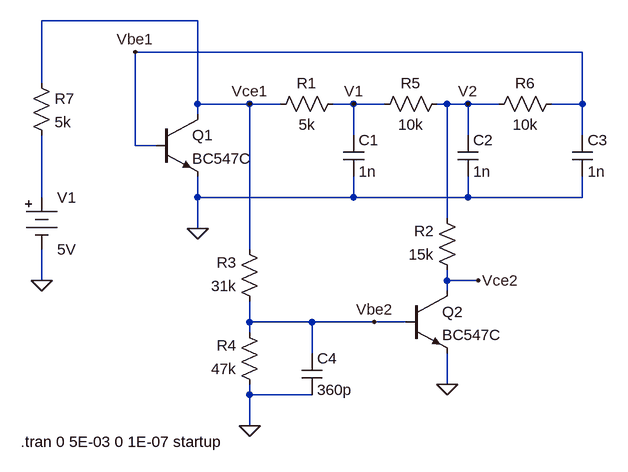
[diagram p0: schematic chaotic_oscillator.asc]
chaotic_oscillator.asc, the LTspice schematic file:
Version 4
SHEET 1 880 680
WIRE -176 -80 -416 -80
WIRE 416 -32 -272 -32
WIRE -416 16 -416 -80
WIRE -176 48 -176 -80
WIRE -96 48 -176 48
WIRE -48 48 -96 48
WIRE 64 48 32 48
WIRE 112 48 64 48
WIRE 208 48 192 48
WIRE 240 48 208 48
WIRE 288 48 240 48
WIRE 416 48 416 -32
WIRE 416 48 368 48
WIRE -176 64 -176 48
WIRE 64 96 64 48
WIRE 240 96 240 48
WIRE 416 96 416 48
WIRE -272 112 -272 -32
WIRE -240 112 -272 112
WIRE -416 192 -416 96
WIRE -176 192 -176 160
WIRE 64 192 64 160
WIRE 64 192 -176 192
WIRE 240 192 240 160
WIRE 240 192 64 192
WIRE 416 192 416 160
WIRE 416 192 240 192
WIRE 208 224 208 48
WIRE -176 240 -176 192
WIRE -96 272 -96 48
WIRE -416 320 -416 272
WIRE 208 320 208 304
WIRE 256 320 208 320
WIRE 208 336 208 320
WIRE -96 384 -96 352
WIRE 0 384 -96 384
WIRE 96 384 0 384
WIRE 144 384 96 384
WIRE -96 400 -96 384
WIRE 0 432 0 384
WIRE 208 480 208 432
WIRE -96 496 -96 480
WIRE 0 496 -96 496
WIRE -96 544 -96 496
FLAG -176 240 0
FLAG 208 480 0
FLAG -96 544 0
FLAG -416 320 0
FLAG 256 320 Vce2
FLAG -272 -32 Vbe1
FLAG -96 48 Vce1
FLAG 64 48 V1
FLAG 240 48 V2
FLAG 96 384 Vbe2
SYMBOL npn -240 64 R0
SYMATTR InstName Q1
SYMATTR Value BC547C
SYMBOL npn 144 336 R0
SYMATTR InstName Q2
SYMATTR Value BC547C
SYMBOL res 48 32 R90
WINDOW 0 0 56 VBottom 2
WINDOW 3 32 56 VTop 2
SYMATTR InstName R1
SYMATTR Value 5k
SYMBOL res 224 320 R180
WINDOW 0 36 76 Left 2
WINDOW 3 36 40 Left 2
SYMATTR InstName R2
SYMATTR Value 15k
SYMBOL res -80 368 R180
WINDOW 0 36 76 Left 2
WINDOW 3 36 40 Left 2
SYMATTR InstName R3
SYMATTR Value 31k
SYMBOL res -80 496 R180
WINDOW 0 36 76 Left 2
WINDOW 3 36 40 Left 2
SYMATTR InstName R4
SYMATTR Value 47k
SYMBOL res 208 32 R90
WINDOW 0 0 56 VBottom 2
WINDOW 3 32 56 VTop 2
SYMATTR InstName R5
SYMATTR Value 10k
SYMBOL res 384 32 R90
WINDOW 0 0 56 VBottom 2
WINDOW 3 32 56 VTop 2
SYMATTR InstName R6
SYMATTR Value 10k
SYMBOL res -432 0 R0
SYMATTR InstName R7
SYMATTR Value 5k
SYMBOL cap 48 96 R0
SYMATTR InstName C1
SYMATTR Value 1n
SYMBOL cap 224 96 R0
SYMATTR InstName C2
SYMATTR Value 1n
SYMBOL cap 400 96 R0
SYMATTR InstName C3
SYMATTR Value 1n
SYMBOL cap -16 432 R0
SYMATTR InstName C4
SYMATTR Value 360p
SYMBOL Misc\\battery -416 176 R0
SYMATTR InstName V1
SYMATTR Value 5V
TEXT -448 568 Left 2 !.tran 0 5E-03 0 1E-07 startup

The netlist it stands for:
* chaotic_oscillator.asc
Q1 Vce1 Vbe1 0 0 BC547C
Q2 Vce2 Vbe2 0 0 BC547C
R1 V1 Vce1 5k
R2 Vce2 V2 15k
R3 Vbe2 Vce1 31k
R4 0 Vbe2 47k
R5 V2 V1 10k
R6 Vbe1 V2 10k
R7 Vce1 N001 5k
C1 V1 0 1n
C2 V2 0 1n
C3 Vbe1 0 1n
C4 Vbe2 0 360p
V1 N001 0 5V
.model NPN NPN
.model PNP PNP
.lib standard.bjt
.tran 0 5E-03 0 1E-07 startup
.backanno
.end